# EAGLE design growleds (EAGLE 8.3.1)
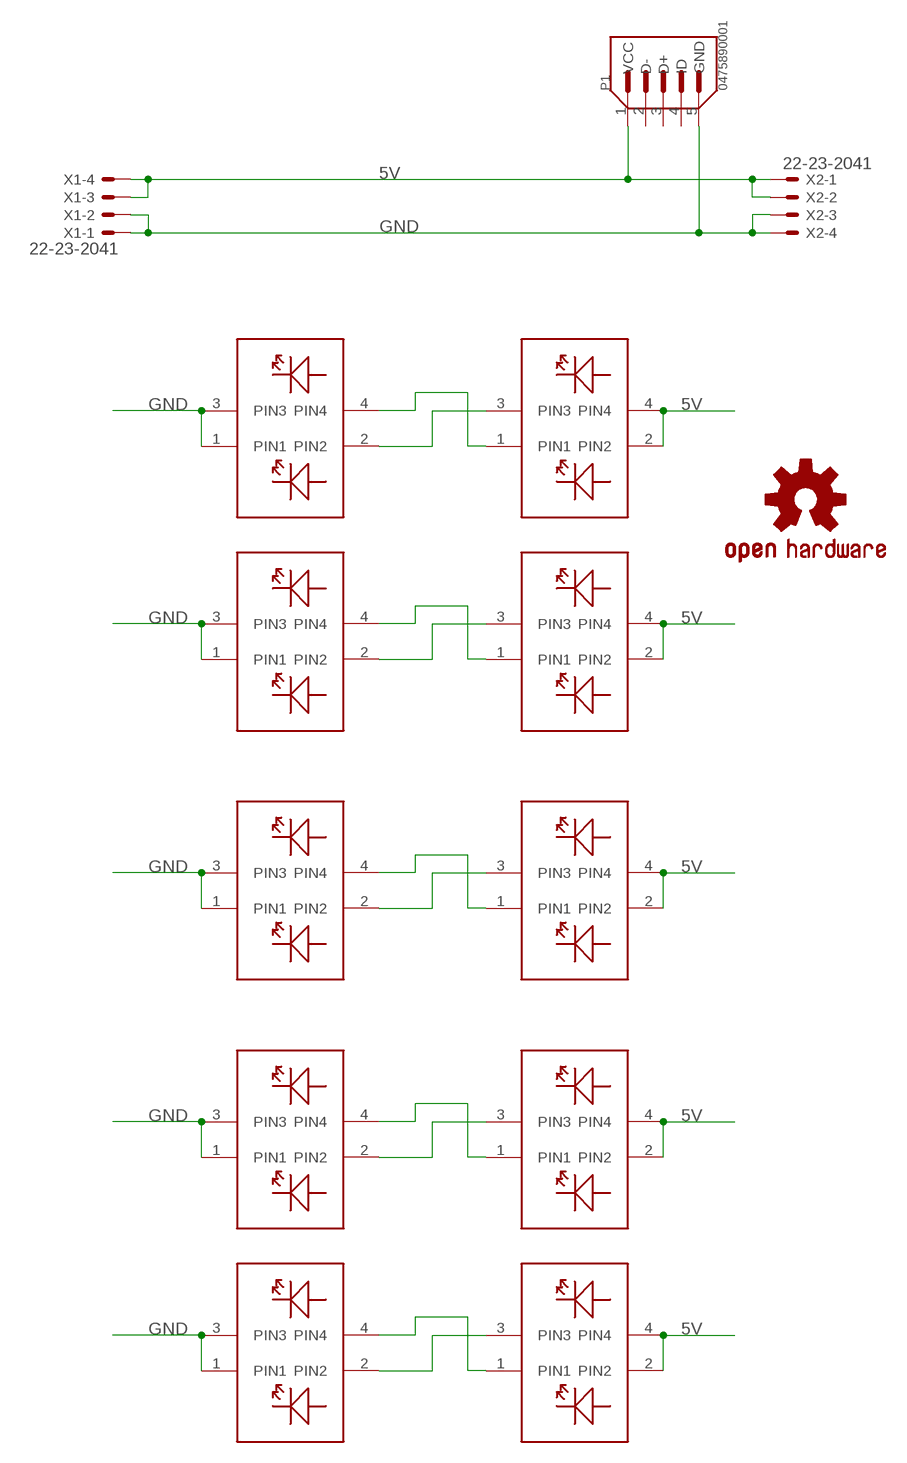
[diagram p0: schematic, sheet 1]

## Parts
LOGO1  OSHW-LOGOM-COPPER  [OSHW-LOGO-M_COPPER]
P1  0475890001  [MOLEX_0475890001]
U$1  RBLED  [4-PLCC]
U$2  RBLED  [4-PLCC]
U$3  RBLED  [4-PLCC]
U$4  RBLED  [4-PLCC]
U$5  RBLED  [4-PLCC]
U$6  RBLED  [4-PLCC]
U$7  RBLED  [4-PLCC]
U$8  RBLED  [4-PLCC]
U$9  RBLED  [4-PLCC]
U$10  RBLED  [4-PLCC]
X1  22-23-2041  [22-23-2041]
X2  22-23-2041  [22-23-2041]

## Nets
5V: P1.1(VCC) U$2.2(PIN2) U$2.4(PIN4) U$4.2(PIN2) U$4.4(PIN4) U$6.2(PIN2) U$6.4(PIN4) U$8.2(PIN2) U$8.4(PIN4) U$10.2(PIN2) U$10.4(PIN4) X1.3 X1.4 X2.1 X2.2
GND: P1.5(GND) U$1.1(PIN1) U$1.3(PIN3) U$3.1(PIN1) U$3.3(PIN3) U$5.1(PIN1) U$5.3(PIN3) U$7.1(PIN1) U$7.3(PIN3) U$9.1(PIN1) U$9.3(PIN3) X1.1 X1.2 X2.3 X2.4
N$1: U$1.2(PIN2) U$2.3(PIN3)
N$2: U$1.4(PIN4) U$2.1(PIN1)
N$3: U$3.2(PIN2) U$4.3(PIN3)
N$4: U$3.4(PIN4) U$4.1(PIN1)
N$5: U$5.2(PIN2) U$6.3(PIN3)
N$6: U$5.4(PIN4) U$6.1(PIN1)
N$7: U$7.2(PIN2) U$8.3(PIN3)
N$8: U$7.4(PIN4) U$8.1(PIN1)
N$9: U$9.2(PIN2) U$10.3(PIN3)
N$10: U$9.4(PIN4) U$10.1(PIN1)
Unconnected: P1.2(D-) P1.3(D+) P1.4(ID)

## Library data of the parts
LOGO1 = SparkFun-Aesthetics:OSHW-LOGO: Open-Source Hardware (OSHW) Logo This logo indicates the piece of hardware it is found on incorporates a OSHW license and/or adheres to the definition of open source hardware found here: http://freedomdefined.org/OSHW
P1 = GROWLED:0475890001: Conn Micro USB Type AB RCP 5 POS 0.65mm Solder RA SMD 5 Terminal 1 Port T/R; AVAILABILITY: Good; DESCRIPTION: Conn Micro USB Type AB RCP 5 POS 0.65mm Solder RA SMD 5 Terminal 1 Port T/R; MF: Molex; MP: 0475890001; PACKAGE: None; PRICE: 0.46 USD
U$1-U$10 = GROWLED:RBLED
X1 X2 = con-molex:22-23-2041: .100" (2.54mm) Center Header - 4 Pin; MF: MOLEX; MPN: 22-23-2041; OC_FARNELL: 1462920; OC_NEWARK: 38C0355

## Net classes
0 default: width 0.305 mm, clearance 0.152 mm

## Board
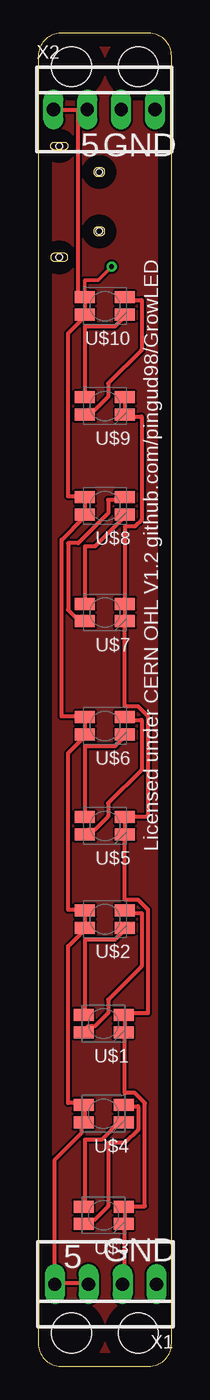
[diagram p1: board, top side]
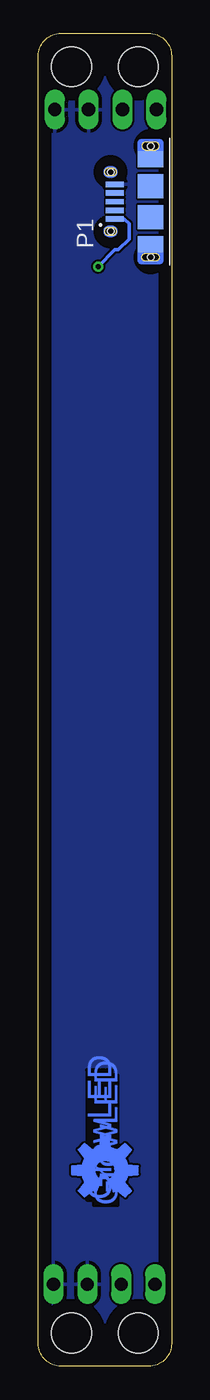
[diagram p2: board, bottom side, seen from below]

Size 10 x 100 mm. Coordinates in mm from the lower left corner, seen from the top.
Outline: 0,98.29 0,1.71 arc90 1.71,0 8.29,0 arc90 10,1.71 10,98.29 arc90 8.29,100 1.71,100 arc90 0,98.29
Copper layers (1*16): Top 0.035mm / dielectric 1.5mm / Bottom 0.035mm
Design rules "default": minimum track width 6mil, minimum drill 0.35mm, track to track 6mil, track to pad 6mil, pad to pad 6mil, via to via 6mil, smd to smd 6mil, copper to edge 40mil, drill to drill 6mil, minimum pad ring 10mil, minimum via ring 8mil, stop-mask expansion 4mil, vias tented up to drill 0mil, thermal gap 10mil
Holes 3 mm at 2.5,2.5 7.5,2.5 2.5,97.5 7.5,97.5

### Footprints (pad centres in the part's own frame; a part is rotated, then mirrored left to right if it is on the bottom)
MOLEX_0475890001 = smd 0.4 x 1.35: 1 -1.3,2.675; 2 -0.65,2.675; 3 0,2.675; 4 0.65,2.675; 5 1.3,2.675 | smd 1.175 x 1.9: 6 -3.187,0; 9 3.187,0 | smd 1.8 x 1.9: 7 -1.15,0; 8 1.15,0 | hole 0.5: -2.225,3; 2.225,3; -4.175,0; 4.175,0
4-PLCC = smd 1.5 x 0.9: 1 -1.5,-0.65; 2 1.5,-0.65; 3 -1.5,0.65; 4 1.5,0.65
22-23-2041 = drill 1 long: 1 -3.81,0; 2 -1.27,0; 3 1.27,0; 4 3.81,0

### Placement (x,y rotation side)
LOGO1  5,14.7 0 bottom
P1  1.58,87.37 90 bottom
U$1  4.9,25.7 180 top
U$2  5,33.54 180 top
U$3  4.9,11.32 180 top
U$4  4.9,18.94 180 top
U$5  5,40.54 180 top
U$6  5,48.04 180 top
U$7  5,56.54 180 top
U$8  5,64.54 180 top
U$9  5,72.04 180 top
U$10  5,79.54 180 top
X1  5.05,6.15 180 top
X2  4.95,94.28 0 top

### Tracks (layer width: path | path; a pad name or v marks a point on that pad's centre or on a via)
5V  (via drill 0.35)
  Top 0.254: 3.5,80.25 3.5,81.5 4.5,81.5 v5.5,82.5
  Top 0.305: 3,94.25 3.5,94.25 X2.2 3,94.25 | 3,94.25 1.25,94.25 X2.1 | 1.25,6.25 1.25,15.5 3.25,17.5 3.25,18.25 U$4.4 3.5,18.5 3.5,19.5 U$4.2 3.25,19.75 2.25,19.75 2.25,31.5 3.5,32.75 U$2.4 U$2.2 3.5,34.25 2.25,34.25 2.25,46 3.5,47.25 U$6.4 U$6.2 3.5,48.75 1.75,48.75 1.75,62 3.5,63.75 U$8.4 U$8.2 3.5,65.25 2.25,65.25 2.25,77.5 3.5,78.75 U$10.4 U$10.2 3.5,80.25 3,80.25 3,94.25 | 1.25,6.25 3.75,6.25 X1.3 | 1.25,6.25 X1.4
  Bottom 0.254: v5.5,82.5 4.25,83.75 4,83.75 3.19,84.57 3.19,85.72 3.54,86.07 P1.1
GND
  Top 0.305: U$9.1 U$9.3 6.5,71.25 7.75,71.25 7.75,63.5 7.25,63 6.5,63 U$7.1 U$7.3 6.5,49.5 7.5,49.5 8.25,48.75 8.25,41.25 6.5,41.25 U$5.1 U$5.3 6.5,35 7.5,35 8.25,34.25 8.25,26.5 6.5,26.5 U$1.1 6.5,26.25 6.5,25.25 U$1.3 6.5,25 6.5,20.5 7.25,20.5 8,19.75 8,12 6.5,12 U$3.1 6.5,11.75 6.5,10.75 U$3.3 6.5,10.5 6.5,6.25 X1.2
  pour Bottom: 0,100 10,100 10,0 0,0
N$1
  Top 0.305: U$1.2 3.5,26.5 3.5,32 5.75,32 6.5,32.75 U$2.3
N$2
  Top 0.305: U$1.4 3.5,25.25 3.75,25.5 4.25,25.5 5.25,26.5 5.25,27.5 7.75,30 7.75,34 6.5,34 U$2.1
N$3
  Top 0.305: U$3.2 3.5,12 3.5,17 4.75,17 6,18.25 6.25,18.25 U$4.3
N$4
  Top 0.305: U$3.4 3.5,10.75 3.75,11 4.25,11 5.25,12 5.25,16.75 6.5,16.75 7.5,17.75 7.5,19.5 6.5,19.5 U$4.1
N$5
  Top 0.305: U$5.2 3.5,46.5 5.75,46.5 6.5,47.25 U$6.3
N$6
  Top 0.305: U$5.4 3.5,40 3.75,40.25 4.25,40.25 5.25,41.25 5.25,42.25 7.75,44.75 7.75,48.5 6.5,48.5 U$6.1
N$7
  Top 0.305: U$7.2 3.5,61.5 4.25,61.5 6.5,63.75 U$8.3
N$8
  Top 0.305: U$7.4 3.5,56 3.25,56.25 2.75,56.25 2.25,56.75 2.25,61.75 3,61.75 5.25,64 5.25,65 6.5,65 U$8.1
N$9
  Top 0.305: U$9.2 3.5,78 5.75,78 6.5,78.75 U$10.3
N$10
  Top 0.305: U$9.4 3.5,71.5 3.75,71.75 4.25,71.75 5.25,72.75 5.25,73.75 7.75,76.25 7.75,80 6.5,80 U$10.1
N$11
  pour Top: 0,100 10,100 10,0 0,0

### Text on the board
Bottom: GrowLED | GrowLED | GrowLED | GrowLED
tPlace: 5 | GND | github.com/pingud98/GrowLED | Licensed under CERN OHL V1.2 | GND | 5
tStop: GrowLED / J.Devine '17